# EAGLE design BLE112Shield_v0.1 (EAGLE 6.5.0)
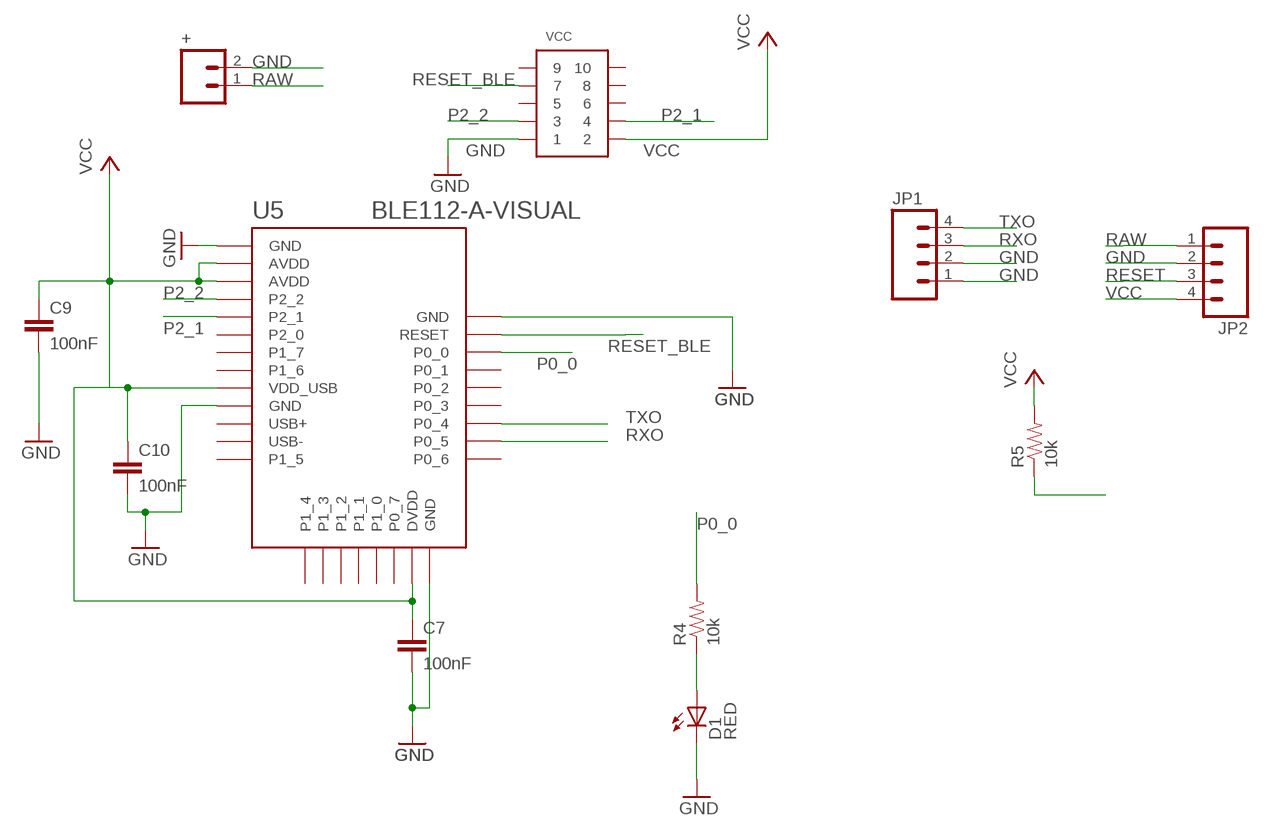
[diagram p0: schematic, sheet 1]

## Parts
+  M021X02_NO_SILK  [1X02_NO_SILK]
C7  100nF  CAP0402-CAP  [0402-CAP]
C9  100nF  CAP0402-CAP  [0402-CAP]
C10  100nF  CAP0402-CAP  [0402-CAP]
D1  RED  LED-RED0603  [LED-0603]
JP1  M04PTH  [1X04]
JP2  M04PTH  [1X04]
R4  10k  RESISTOR0402-RES  [0402-RES]
R5  10k  RESISTOR0402-RES  [0402-RES]
U5  BLE112-A-VISUAL  [BLE112-A]
VCC  CONN_5-2-FTSH-V  [FTSH-105-DV]

## Nets
GND: +.2 C7.2 C9.2 C10.2 D1.C JP1.1 JP1.2 JP2.2 U5.GND1(GND) U5.GND2(GND) U5.GND3(GND) U5.GND4(GND) VCC.1
N$22: D1.A R4.1
P0_0: R4.2 U5.P0_0
P2_1: U5.P2_1 VCC.4
P2_2: U5.P2_2 VCC.3
RAW [vcc]: +.1 JP2.1
RESET: JP2.3
RESET_BLE: R5.1 U5.RESET VCC.7
RXO: JP1.3 U5.P0_5
TXO: JP1.4 U5.P0_4
VCC: C7.1 C9.1 C10.1 JP2.4 R5.2 U5.AVDD1(AVDD) U5.AVDD2(AVDD) U5.DVDD U5.VDD_USB VCC.2
Unconnected: U5.P0_1 U5.P0_2 U5.P0_3 U5.P0_6 U5.P0_7 U5.P1_0 U5.P1_1 U5.P1_2 U5.P1_3 U5.P1_4 U5.P1_5 U5.P1_6 U5.P1_7 U5.P2_0 U5.USB+ U5.USB- VCC.5 VCC.6 VCC.8 VCC.9 VCC.10

## Library data of the parts
+ = SparkFun-Connectors:M02: Header 2 Standard 2-pin 0.1" header. Use with straight break away headers (SKU : PRT-00116), right angle break away headers (PRT-00553), swiss pins (PRT-00743), machine pins (PRT-00117), and female headers (PRT-00115). Molex polarized connector foot print use with SKU : PRT-08233 with associated crimp pins and housings.
C7 C9 C10 = SparkFun-Capacitors:CAP: Capacitor Standard 0603 ceramic capacitor, and 0.1" leaded capacitor.
D1 = SparkFun-LED:LED-RED: Assorted Red LEDs LilyPad 1206- DIO-09912 1206- DIO-00809 0603- DIO-00819; PROD_ID: DIO-00819
JP1 JP2 = SparkFun-Connectors:M04: Header 4 Standard 4-pin 0.1" header. Use with straight break away headers (SKU : PRT-00116), right angle break away headers (PRT-00553), swiss pins (PRT-00743), machine pins (PRT-00117), and female headers (PRT-00115). Molex polarized connector foot print use with SKU : PRT-08231 with associated crimp pins and housings. 1MM SMD Version SKU: PRT-10208
R4 R5 = SparkFun-Resistors:RESISTOR: Resistor Basic schematic elements and footprints for 0603, 1206, and PTH resistors.
U5 = BLE-Shield-1_0_0-B:BLE112-A-VISUAL: Bluetooth Low Energy single-mode module - Bluetooth 4.0, chip antenna
VCC = BLE-Shield-connectors:CONN_5-2

## Net classes
0 default: width 0.203 mm

## Board
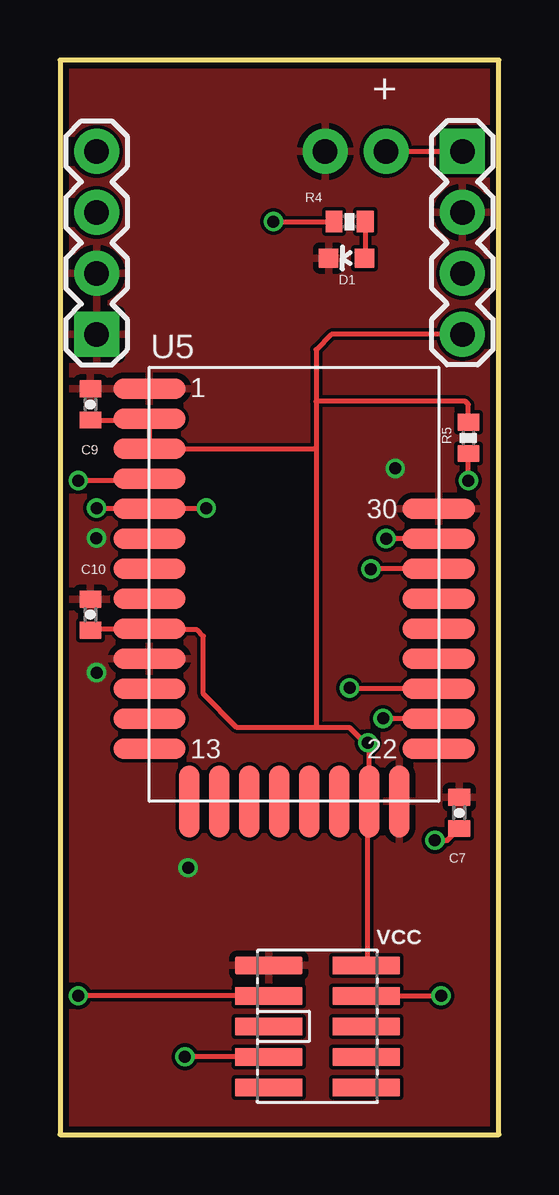
[diagram p1: board, top side]
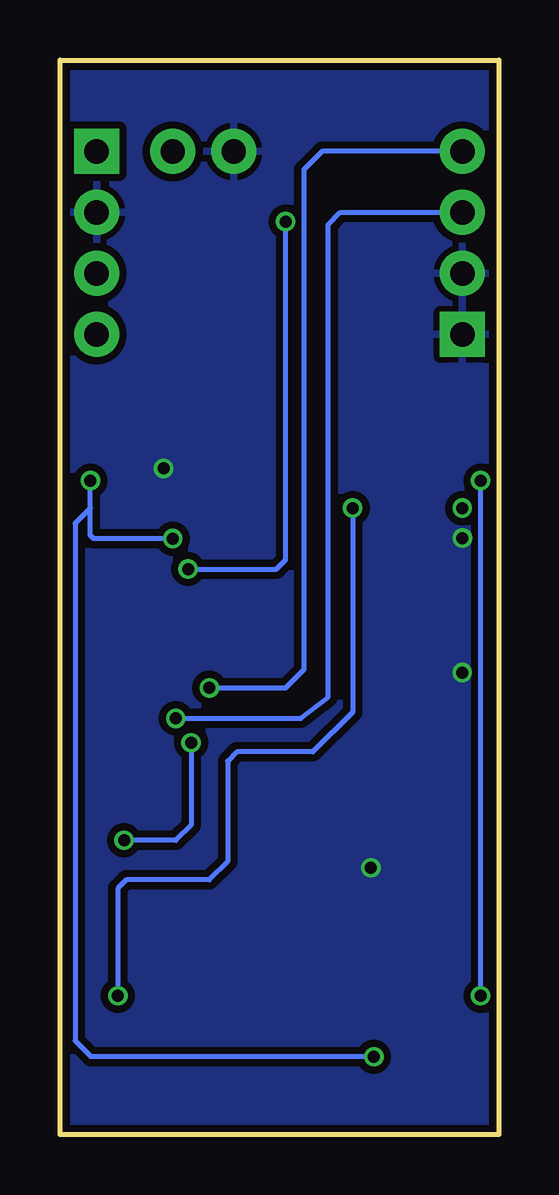
[diagram p2: board, bottom side, seen from below]

Size 18.29 x 44.77 mm. Coordinates in mm from the lower left corner, seen from the top.
Outline: 0,44.77 0,0 18.29,0 18.29,44.77 0,44.77
Copper layers (1*2*15*16): Top 0.035mm / dielectric 0.2mm / Route2 0.0175mm / dielectric 1.1mm / Route15 0.0175mm / dielectric 0.2mm / Bottom 0.035mm
Design rules "SeeedStudio_DRU_no_angle_20130527": minimum track width 6mil, minimum drill 12mil, track to track 6mil, track to pad 6mil, pad to pad 6mil, via to via 6mil, smd to smd 0mil, copper to edge 10mil, drill to drill 10mil, minimum pad ring 6mil, minimum via ring 6mil, stop-mask expansion 2mil, vias tented up to drill 25mil, thermal gap 10mil

### Footprints (pad centres in the part's own frame; a part is rotated, then mirrored left to right if it is on the bottom)
1X02_NO_SILK = drill 1.016 pad 1.88: 1 0,0; 2 2.54,0
0402-CAP = smd 0.7 x 0.9: 1 -0.65,0; 2 0.65,0
LED-0603 = smd 0.8 x 0.8: A 0,-0.75; C 0,0.75
1X04 = drill 1.016 pad 1.88 square: 1 0,0 | drill 1.016 pad 1.88: 2 2.54,0; 3 5.08,0; 4 7.62,0
0402-RES = smd 0.7 x 0.9: 1 -0.65,0; 2 0.65,0
BLE112-A = smd 3 x 0.85: AVDD1 -6.05,6.9; AVDD2 -6.05,5.65; GND1 -6.05,8.15; GND2 -6.05,-3.1; GND4 6,3.15; P0_0 6,0.65; P0_1 6,-0.6; P0_2 6,-1.85; P0_3 6,-3.1; P0_4 6,-4.35; P0_5 6,-5.6; P0_6 6,-6.85; P1_5 -6.05,-6.85; P1_6 -6.05,-0.6; P1_7 -6.05,0.65; P2_0 -6.05,1.9; P2_1 -6.05,3.15; P2_2 -6.05,4.4; RESET 6,1.9; USB+ -6.05,-4.35; USB- -6.05,-5.6; VDD_USB -6.05,-1.85 | smd 0.85 x 3: DVDD 3.1,-9.05; GND3 4.35,-9.05; P0_7 1.85,-9.05; P1_0 0.6,-9.05; P1_1 -0.65,-9.05; P1_2 -1.9,-9.05; P1_3 -3.15,-9.05; P1_4 -4.4,-9.05
FTSH-105-DV = smd 0.74 x 2.8: 1 -2.54,-2.03; 2 -2.54,2.03; 3 -1.27,-2.03; 4 -1.27,2.03; 5 0,-2.03; 6 0,2.03; 7 1.27,-2.03; 8 1.27,2.03; 9 2.54,-2.03; 10 2.54,2.03

### Placement (x,y rotation side)
+  13.59,40.96 180 top
C7  16.64,13.41 90 top
C9  1.27,30.42 90 top
C10  1.27,21.66 90 top
D1  11.94,36.52 90 top
JP1  1.52,33.34 90 top
JP2  16.76,40.96 270 top
R4  12.06,38.04 180 top
R5  17.02,29.03 90 top
U5  9.78,22.93 0 top
VCC  10.73,4.5 270 top

### Tracks (layer width: path | path; a pad name or v marks a point on that pad's centre or on a via)
GND  (via drill 0.5)
  other vias: 13.97,27.76 1.52,24.85 1.52,19.25 5.33,11.12
  pour Top: 0.2,44.88 0.2,0 18.08,0 18.08,44.88
  pour Bottom (isolate 0.305): 0.2,44.88 0.2,0 18.08,0 18.08,44.88
N$22
  Top 0.203: R4.1 12.71,36.55 D1.A
P0_0  (via drill 0.5)
  Top 0.203: U5.P0_0 12.97,23.58 v12.95,23.56 | v8.89,38.04 R4.2
  Bottom 0.203: v12.95,23.56 9.27,23.56 8.89,23.95 v8.89,38.04
P2_1  (via drill 0.5)
  Top 0.203: U5.P2_1 1.52,26.08 v1.52,26.11 v6.1,26.11 | VCC.4 15.87,5.77 v15.87,5.78
  Bottom 0.203: v6.1,26.11 6.1,17.6 7.75,15.95 10.92,15.95 11.3,15.56 11.3,11.37 12.06,10.61 15.53,10.61 15.87,10.26 v15.87,5.78
P2_2  (via drill 0.5)
  Top 0.203: U5.P2_2 3.65,27.25 v0.76,27.25 | VCC.3 0.76,5.77 v0.76,5.78
  Bottom 0.203: v0.76,5.78 v0.76,27.25
RAW
  Top 0.203: +.1 JP2.1
RESET_BLE  (via drill 0.5)
  Top 0.203: U5.RESET v13.59,24.83 | v17.02,27.25 R5.1 | VCC.7 5.21,3.23 v5.21,3.25
  Bottom 0.203: v13.59,24.83 16.89,24.83 17.02,24.96 17.02,26.11 | 17.02,26.11 v17.02,27.25 | 17.02,26.11 17.65,25.47 17.65,3.91 16.99,3.25 v5.21,3.25
RXO  (via drill 0.5)
  Top 0.203: U5.P0_5 13.22,17.33 v13.46,17.34
  Bottom 0.203: v13.46,17.34 8.25,17.34 7.11,18.23 7.11,37.92 6.6,38.42 JP1.3
TXO  (via drill 0.5)
  Top 0.203: U5.P0_4 12.1,18.58 v12.06,18.61
  Bottom 0.203: JP1.4 7.37,40.96 8.13,40.2 8.13,19.37 8.89,18.61 v12.06,18.61
VCC  (via drill 0.5)
  Top 0.203: U5.DVDD 12.88,16.27 v12.83,16.33 | v15.62,12.26 16.14,12.26 C7.1 | U5.DVDD 12.88,16.15 12.06,16.96 10.67,16.96 | 10.67,16.96 7.37,16.96 5.97,18.36 5.97,20.77 5.71,21.02 3.78,21.02 U5.VDD_USB | 3.91,20.9 U5.VDD_USB | C10.1 1.33,21.08 2.85,21.08 2.92,21.15 3.66,21.15 U5.VDD_USB | U5.AVDD1 U5.AVDD2 10.6,28.58 10.67,28.64 | 3.9,29.66 U5.AVDD1 | JP2.4 11.3,33.34 10.67,32.71 10.67,30.55 | 10.67,30.55 10.67,28.64 | 10.67,28.64 10.67,16.96 | R5.2 17.02,30.42 16.89,30.55 10.67,30.55 | C9.1 2.65,29.77 2.67,29.79 3.69,29.79 U5.AVDD1 | U5.DVDD 12.88,12.95 12.83,12.9 12.83,7.04 VCC.2
  Bottom 0.203: v12.83,16.33 12.83,12.9 13.46,12.26 v15.62,12.26